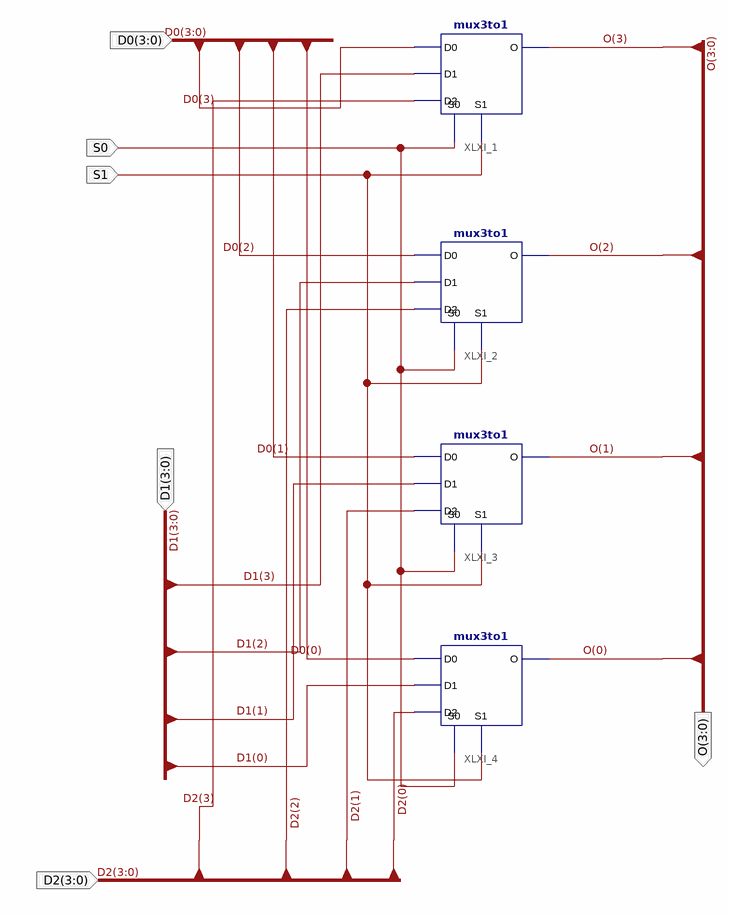
[diagram p0: schematic sheet 1]
// Xilinx ISE schematic mux4bit3to1.sch (spartan3e) as structural Verilog: 4 symbols, 6 ports
module mux4bit3to1 (
  input  [3:0] D0,
  input  [3:0] D1,
  input  [3:0] D2,
  input  S0,
  input  S1,
  output [3:0] O
);

  mux3to1 XLXI_1 (.D0(D0[3]), .D1(D1[3]), .D2(D2[3]), .O(O[3]), .S0(S0), .S1(S1));
  mux3to1 XLXI_2 (.D0(D0[2]), .D1(D1[2]), .D2(D2[2]), .O(O[2]), .S0(S0), .S1(S1));
  mux3to1 XLXI_3 (.D0(D0[1]), .D1(D1[1]), .D2(D2[1]), .O(O[1]), .S0(S0), .S1(S1));
  mux3to1 XLXI_4 (.D0(D0[0]), .D1(D1[0]), .D2(D2[0]), .O(O[0]), .S0(S0), .S1(S1));
endmodule
